# EAGLE design latch_shield_bittern (EAGLE 6.5.0)
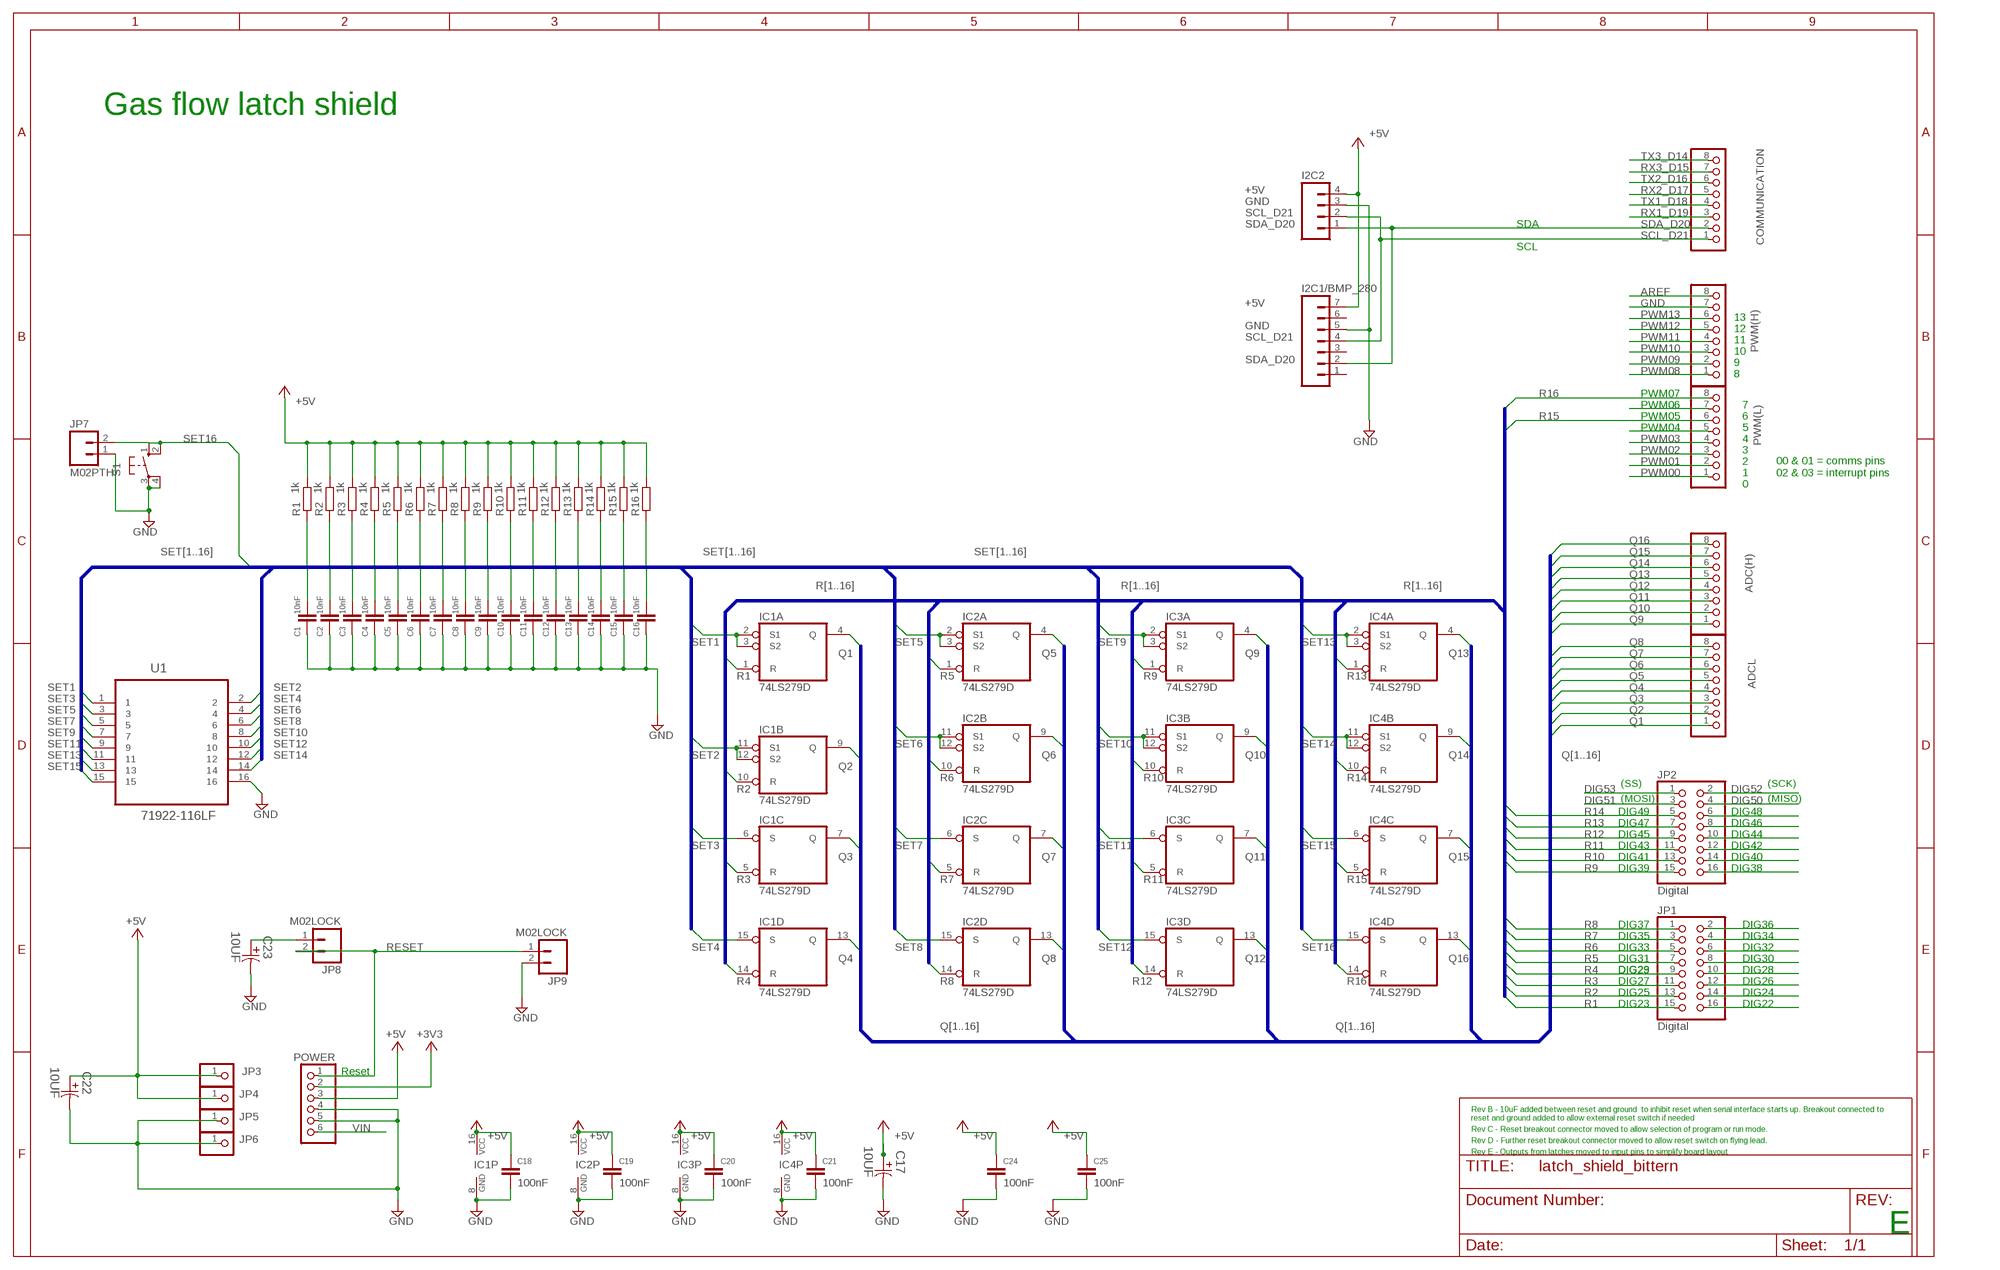
[diagram p0: schematic, sheet 1]

## Parts
ADC(H)  PINHD-1X8  [1X08]
ADCL  PINHD-1X8  [1X08]
C1  10nF  C-EUC0603  [C0603]
C2  10nF  C-EUC0603  [C0603]
C3  10nF  C-EUC0603  [C0603]
C4  10nF  C-EUC0603  [C0603]
C5  10nF  C-EUC0603  [C0603]
C6  10nF  C-EUC0603  [C0603]
C7  10nF  C-EUC0603  [C0603]
C8  10nF  C-EUC0603  [C0603]
C9  10nF  C-EUC0603  [C0603]
C10  10nF  C-EUC0603  [C0603]
C11  10nF  C-EUC0603  [C0603]
C12  10nF  C-EUC0603  [C0603]
C13  10nF  C-EUC0603  [C0603]
C14  10nF  C-EUC0603  [C0603]
C15  10nF  C-EUC0603  [C0603]
C16  10nF  C-EUC0603  [C0603]
C17  10UF  EEE-1VA100SR-CASE-C  [CAPAE530X610N]
C18  100nF  C-EUC0603  [C0603]
C19  100nF  C-EUC0603  [C0603]
C20  100nF  C-EUC0603  [C0603]
C21  100nF  C-EUC0603  [C0603]
C22  10UF  EEE-1VA100SR-CASE-C  [CAPAE530X610N]
C23  10UF  EEE-1VA100SR-CASE-C  [CAPAE530X610N]
C24  100nF  C-EUC0603  [C0603]
C25  100nF  C-EUC0603  [C0603]
COMMUNICATION  PINHD-1X8  [1X08]
I2C1/BMP_280  M07  [1X07]
I2C2  M04PTH  [1X04]
IC1  74LS279D  [SO16]
IC2  74LS279D  [SO16]
IC3  74LS279D  [SO16]
IC4  74LS279D  [SO16]
JP1  Digital  PINHD-2X8  [2X08]
JP2  Digital  PINHD-2X8  [2X08]
JP3  PINHD-1X1  [1X01]
JP4  PINHD-1X1  [1X01]
JP5  PINHD-1X1  [1X01]
JP6  PINHD-1X1  [1X01]
JP7  M02PTH  [1X02]
JP8  M02LOCK  [1X02_LOCK]
JP9  M02LOCK  [1X02_LOCK]
POWER  PINHD-1X6  [1X06]
PWM(H)  PINHD-1X8  [1X08]
PWM(L)  PINHD-1X8  [1X08]
R1  1k  R-EU_R0603  [R0603]
R2  1k  R-EU_R0603  [R0603]
R3  1k  R-EU_R0603  [R0603]
R4  1k  R-EU_R0603  [R0603]
R5  1k  R-EU_R0603  [R0603]
R6  1k  R-EU_R0603  [R0603]
R7  1k  R-EU_R0603  [R0603]
R8  1k  R-EU_R0603  [R0603]
R9  1k  R-EU_R0603  [R0603]
R10  1k  R-EU_R0603  [R0603]
R11  1k  R-EU_R0603  [R0603]
R12  1k  R-EU_R0603  [R0603]
R13  1k  R-EU_R0603  [R0603]
R14  1k  R-EU_R0603  [R0603]
R15  1k  R-EU_R0603  [R0603]
R16  1k  R-EU_R0603  [R0603]
S1  10-XX  [B3F-10XX]
U1  71922-116LF  [FCI_71922-116LF]

## Nets
+3V3 [power]: POWER.2
+5V [usbvcc]: C17.1 C18.1 C19.1 C20.1 C21.1 C22.1 C24.1 C25.1 I2C1/BMP_280.7 I2C2.4 IC1.16(P:VCC) IC2.16(P:VCC) IC3.16(P:VCC) IC4.16(P:VCC) JP3.1 JP4.1 POWER.3 R1.2 R2.2 R3.2 R4.2 R5.2 R6.2 R7.2 R8.2 R9.2 R10.2 R11.2 R12.2 R13.2 R14.2 R15.2 R16.2
AREF: PWM(H).8
DIG50: JP2.4
DIG51: JP2.3
DIG52: JP2.2
DIG53: JP2.1
GND [gnd]: C1.1 C2.1 C3.1 C4.1 C5.1 C6.1 C7.1 C8.1 C9.1 C10.1 C11.1 C12.1 C13.1 C14.1 C15.1 C16.1 C17.2 C18.2 C19.2 C20.2 C21.2 C22.2 C23.2 C24.2 C25.2 I2C1/BMP_280.5 I2C2.3 IC1.8(P:GND) IC2.8(P:GND) IC3.8(P:GND) IC4.8(P:GND) JP5.1 JP6.1 JP7.1 JP9.2 POWER.4 POWER.5 PWM(H).7 S1.3(P) S1.4(P1) U1.16
N$1: C23.1 JP8.1
N$2: PWM(L).5
N$3: PWM(L).7
N$4: JP2.6
N$5: JP2.8
N$6: JP2.10
N$7: JP2.12
N$8: JP2.14
N$9: JP2.16
N$10: JP1.2
N$11: JP1.4
N$12: JP1.6
N$13: JP1.8
N$14: JP1.10
N$15: JP1.12
N$16: JP1.14
N$17: JP1.16
PWM00: PWM(L).1
PWM01: PWM(L).2
PWM02: PWM(L).3
PWM03: PWM(L).4
PWM08: PWM(H).1
PWM09: PWM(H).2
PWM10: PWM(H).3
PWM11: PWM(H).4
PWM12: PWM(H).5
PWM13: PWM(H).6
Q1: ADCL.1 IC1.4(A:Q)
Q2: ADCL.2 IC1.9(B:Q)
Q3: ADCL.3 IC1.7(C:Q)
Q4: ADCL.4 IC1.13(D:Q)
Q5: ADCL.5 IC2.4(A:Q)
Q6: ADCL.6 IC2.9(B:Q)
Q7: ADCL.7 IC2.7(C:Q)
Q8: ADCL.8 IC2.13(D:Q)
Q9: ADC(H).1 IC3.4(A:Q)
Q10: ADC(H).2 IC3.9(B:Q)
Q11: ADC(H).3 IC3.7(C:Q)
Q12: ADC(H).4 IC3.13(D:Q)
Q13: ADC(H).5 IC4.4(A:Q)
Q14: ADC(H).6 IC4.9(B:Q)
Q15: ADC(H).7 IC4.7(C:Q)
Q16: ADC(H).8 IC4.13(D:Q)
R1: IC1.1(A:R) JP1.15
R2: IC1.10(B:R) JP1.13
R3: IC1.5(C:R) JP1.11
R4: IC1.14(D:R) JP1.9
R5: IC2.1(A:R) JP1.7
R6: IC2.10(B:R) JP1.5
R7: IC2.5(C:R) JP1.3
R8: IC2.14(D:R) JP1.1
R9: IC3.1(A:R) JP2.15
R10: IC3.10(B:R) JP2.13
R11: IC3.5(C:R) JP2.11
R12: IC3.14(D:R) JP2.9
R13: IC4.1(A:R) JP2.7
R14: IC4.10(B:R) JP2.5
R15: IC4.5(C:R) PWM(L).6
R16: IC4.14(D:R) PWM(L).8
RESET: JP8.2 JP9.1 POWER.1
RX1_D19: COMMUNICATION.3
RX2_D17: COMMUNICATION.5
RX3_D15: COMMUNICATION.7
SCL_D21: COMMUNICATION.1 I2C1/BMP_280.4 I2C2.2
SDA_D20: COMMUNICATION.2 I2C1/BMP_280.2 I2C2.1
SET1: C1.2 IC1.2(A:S1) IC1.3(A:S2) R1.1 U1.1
SET2: C2.2 IC1.11(B:S1) IC1.12(B:S2) R2.1 U1.2
SET3: C3.2 IC1.6(C:S) R3.1 U1.3
SET4: C4.2 IC1.15(D:S) R4.1 U1.4
SET5: C5.2 IC2.2(A:S1) IC2.3(A:S2) R5.1 U1.5
SET6: C6.2 IC2.11(B:S1) IC2.12(B:S2) R6.1 U1.6
SET7: C7.2 IC2.6(C:S) R7.1 U1.7
SET8: C8.2 IC2.15(D:S) R8.1 U1.8
SET9: C9.2 IC3.2(A:S1) IC3.3(A:S2) R9.1 U1.9
SET10: C10.2 IC3.11(B:S1) IC3.12(B:S2) R10.1 U1.10
SET11: C11.2 IC3.6(C:S) R11.1 U1.11
SET12: C12.2 IC3.15(D:S) R12.1 U1.12
SET13: C13.2 IC4.2(A:S1) IC4.3(A:S2) R13.1 U1.13
SET14: C14.2 IC4.11(B:S1) IC4.12(B:S2) R14.1 U1.14
SET15: C15.2 IC4.6(C:S) R15.1 U1.15
SET16: C16.2 IC4.15(D:S) JP7.2 R16.1 S1.1(S) S1.2(S1)
TX1_D18: COMMUNICATION.4
TX2_D16: COMMUNICATION.6
TX3_D14: COMMUNICATION.8
VIN [power]: POWER.6
Unconnected: I2C1/BMP_280.1 I2C1/BMP_280.3 I2C1/BMP_280.6

## Buses
Q[1..16]
R[1..16]
SET[1..16]

## Notes on the sheet
- Gas flow latch shield
- SDA
- SCL
- 13
- 12
- 11
- 10
- 9
- 8
- PWM07
- PWM06 | 7
- PWM05 | 6
- PWM04 | 5
- 4
- 3
- 2
- 1
- 00 & 01 = comms pins
  02 & 03 = interrupt pins
- 0
- (SS) | (SCK)
- (MOSI) | (MISO)
- DIG49 | DIG48
- DIG47 | DIG46
- DIG45 | DIG44
- DIG43 | DIG42
- DIG41 | DIG40
- DIG39 | DIG38
- DIG37 | DIG36
- DIG35 | DIG34
- DIG33 | DIG32
- DIG31 | DIG30
- DIG23 | DIG29 | DIG28
- DIG27 | DIG26
- DIG25 | DIG24
- DIG23 | DIG22
- Reset
- Rev B - 10uF added between reset and ground  to inhibit reset when serial interface starts up. Breakout connected to 
  reset and ground added to allow external reset switch if needed
- Rev C - Reset breakout connector moved to allow selection of program or run mode.
- Rev D - Further reset breakout connector moved to allow reset switch on flying lead.
- Rev E - Outputs from latches moved to input pins to simplify board layout
- E

## Library data of the parts
ADC(H) ADCL COMMUNICATION PWM(H) PWM(L) = pinhead:PINHD-1X8: PIN HEADER
C1-C16 C18-C21 C24 C25 = rcl:C-EU: CAPACITOR, European symbol
C17 C22 C23 = Panasonic-EEE0_EEE1_EEE2_EEEFC:EEE-: Aluminum Electrolytic Capacitors,Surface Mount Type; MPN: EEE-1VA100SR; OC_FARNELL: 9697012; OC_NEWARK: 96K9441; PACKAGE: CASE-C; SUPPLIER: PANASONIC; TOLERANCE: 20%; VOLTAGERATING: 35V
I2C1/BMP_280 = SparkFun-Connectors:M07: Header 7 Standard 7-pin 0.1" header. Use with straight break away headers (SKU : PRT-00116), right angle break away headers (PRT-00553), swiss pins (PRT-00743), machine pins (PRT-00117), and female headers (PRT-00115). NOTES ON THE VARIANTS LOCK and LOCK_LONGPADS... This footprint was designed to help hold the alignment of a through-hole component (i.e. 7-pin header) while soldering it into place. You may notice that each hole has been shifted either up or down by 0.005 of an inch from it's more standard position (which is usually a perfectly straight line). This slight alteration caused the pins (the squares in the middle) to touch the edges of the holes. Because they are alternating, it causes a "brace" to hold the header in place. 0.005 has proven to be the perfect amount of "off-center" position when using our standard breakaway headers. Although looks a little odd when you look at the bare footprint, once you have a header in there, the alteration is very hard to notice. Also, if you push a header all the way into place, it is covered up entirely on the bottom side. This idea of altering the position of holes to aid alignment will be further integrated into the Sparkfun Library for other footprints. It can help hold any component with 3 or more connection pins.
I2C2 = SparkFun-Connectors:M04: Header 4 Standard 4-pin 0.1" header. Use with straight break away headers (SKU : PRT-00116), right angle break away headers (PRT-00553), swiss pins (PRT-00743), machine pins (PRT-00117), and female headers (PRT-00115). Molex polarized connector foot print use with SKU : PRT-08231 with associated crimp pins and housings. 1MM SMD Version SKU: PRT-10208
IC1-IC4 = 74xx-eu:74*279: Quadruple S-R LATCH
JP1 JP2 = pinhead:PINHD-2X8: PIN HEADER
JP3-JP6 = pinhead:PINHD-1X1: PIN HEADER
JP7-JP9 = SparkFun-Connectors:M02: Standard 2-pin 0.1" header. Use with - straight break away headers ( PRT-00116) - right angle break away headers (PRT-00553) - swiss pins (PRT-00743) - machine pins (PRT-00117) - female headers (PRT-00115) Molex polarized connector foot print use with: PRT-08233 with associated crimp pins and housings. 2.54_SCREWTERM for use with PRT-10571. 3.5mm Screw Terminal footprints for PRT-08084 5mm Screw Terminal footprints for use with PRT-08433
POWER = pinhead:PINHD-1X6: PIN HEADER
R1-R16 = rcl:R-EU_: RESISTOR, European symbol
S1 = switch-omron:10-XX: OMRON SWITCH; MPN: B3F-1000; OC_FARNELL: 176432; OC_NEWARK: 36M3542
U1 = FCI_By_element14_Batch_1:71922-116LF: LATCH HEADER, RIGHT ANGLE; MPN: 71922-116LF; OC_FARNELL: 1103947; OC_NEWARK: 93K5024; PACKAGE: CON-16 WAYS; SUPPLIER: FCI

## Net classes
0 default: width 0.203 mm, drill 0.406 mm, clearance 0.203 mm
1 power: width 0.61 mm, drill 0.711 mm, clearance 0.203 mm
2 gnd: width 0.305 mm, drill 0.711 mm, clearance 0.203 mm
3 usbvcc: width 0.508 mm, drill 0.711 mm, clearance 0.203 mm

## Board
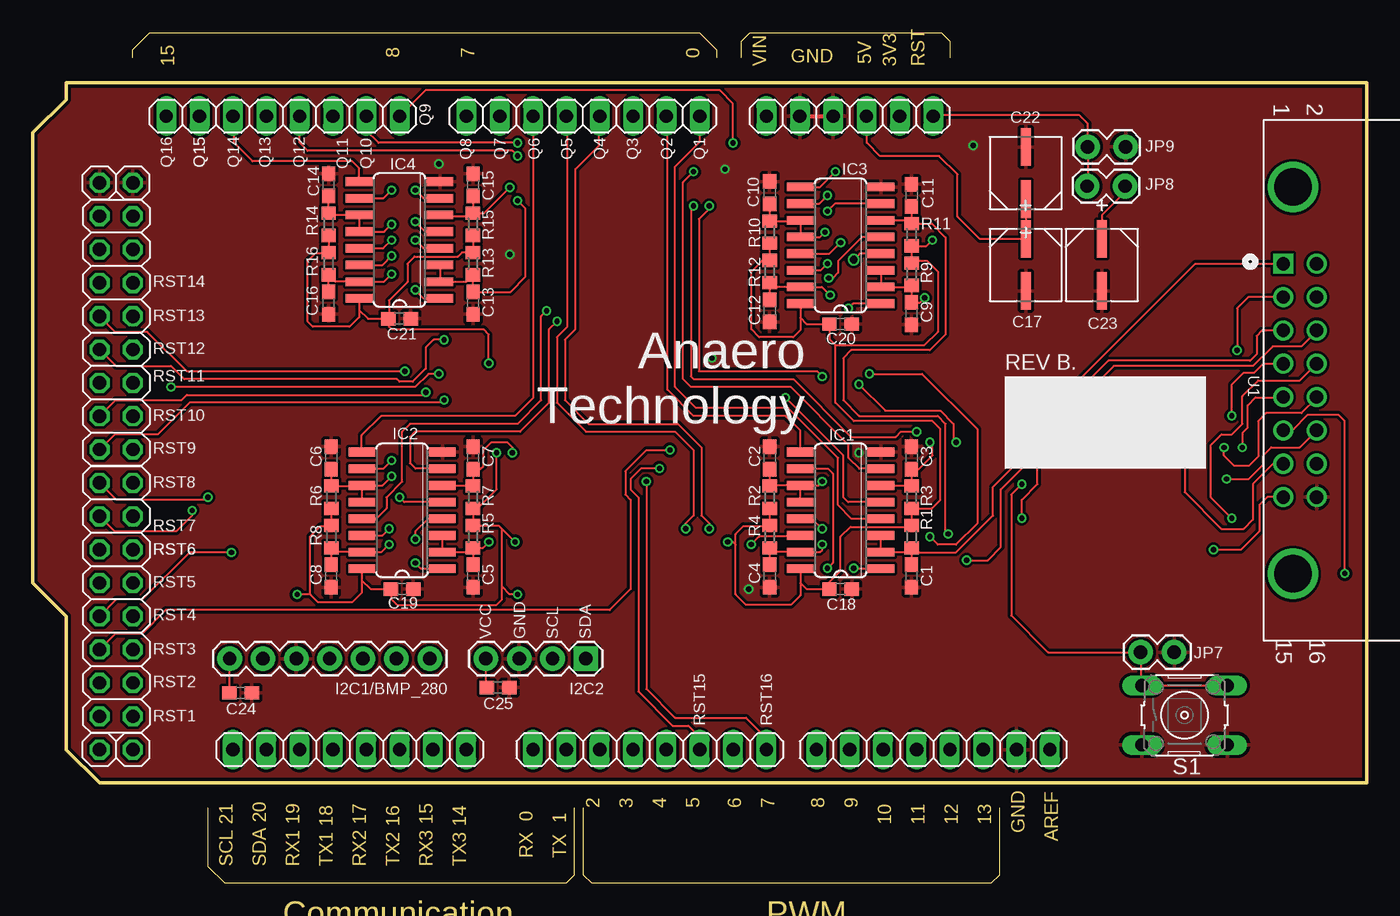
[diagram p1: board, top side]
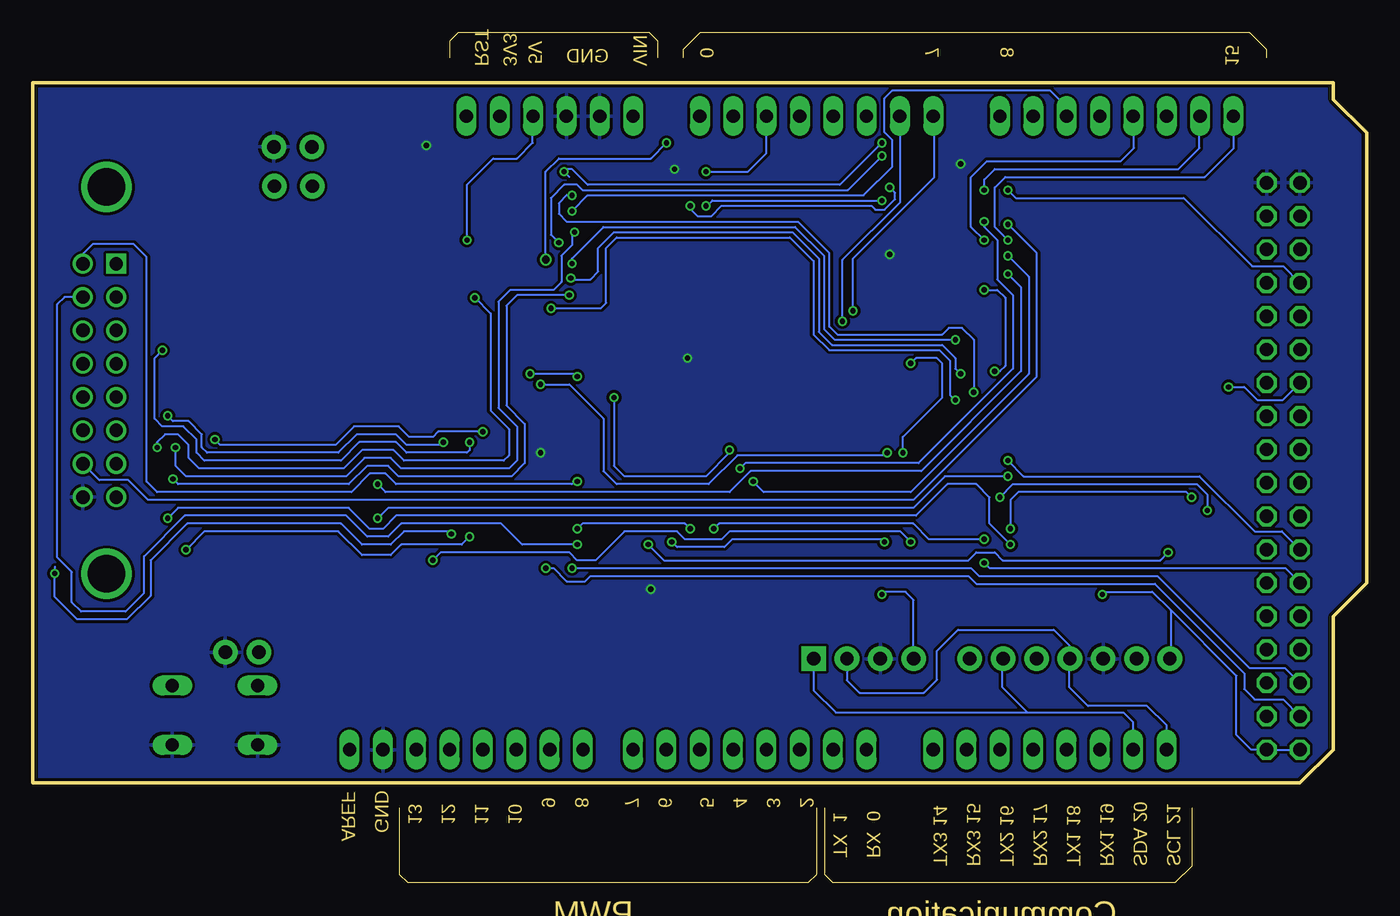
[diagram p2: board, bottom side, seen from below]

Size 101.6 x 64.77 mm. Coordinates in mm from the lower left corner, seen from the top.
Outline: 7.62,62.87 7.62,63.5 8.89,64.77 50.8,64.77 52.07,63.5 52.07,62.87
Outline: 53.97,62.87 53.97,64.14 54.61,64.77 69.22,64.77 69.85,64.14 69.85,62.87
Outline: 13.34,5.71 13.34,1.27 14.61,0 40.64,0 41.27,0.64 41.27,5.71
Outline: 41.91,5.71 41.91,0.64 42.54,0 73.03,0 73.66,0.64 73.66,5.71
Outline: 101.6,7.62 5.08,7.62 2.54,10.16 2.54,20.32 0,22.86 0,57.15 2.54,59.69 2.54,60.96 101.6,60.96 101.6,7.62
Copper layers (1*2*15*16): Top 0.035mm / dielectric 0.2mm / Route2 0.0175mm / dielectric 1.1mm / Route15 0.0175mm / dielectric 0.2mm / Bottom 0.035mm
Design rules "SeeedStudio_DRU_no_angle_20130527 *": minimum track width 6mil, minimum drill 9mil, track to track 6mil, track to pad 6mil, pad to pad 6mil, via to via 6mil, smd to smd 0mil, copper to edge 10mil, drill to drill 10mil, minimum pad ring 6mil, minimum via ring 6mil, stop-mask expansion 2mil, vias tented up to drill 25mil, thermal gap 10mil

### Footprints (pad centres in the part's own frame; a part is rotated, then mirrored left to right if it is on the bottom)
1X08 = drill 1.016 long: 1 -8.89,0; 2 -6.35,0; 3 -3.81,0; 4 -1.27,0; 5 1.27,0; 6 3.81,0; 7 6.35,0; 8 8.89,0
C0603 = smd 1.1 x 1: 1 -0.85,0; 2 0.85,0
CAPAE530X610N = smd 2.87 x 0.762: 1 -1.981,0; 2 1.981,0
1X07 = drill 1.016 pad 1.88: 1 0,0; 2 2.54,0; 3 5.08,0; 4 7.62,0; 5 10.16,0; 6 12.7,0; 7 15.24,0
1X04 = drill 1.016 pad 1.88 square: 1 0,0 | drill 1.016 pad 1.88: 2 2.54,0; 3 5.08,0; 4 7.62,0
SO16 = smd 0.66 x 2.032: 1 -4.445,-3.073; 2 -3.175,-3.073; 3 -1.905,-3.073; 4 -0.635,-3.073; 5 0.635,-3.073; 6 1.905,-3.073; 7 3.175,-3.073; 8 4.445,-3.073; 9 4.445,3.073; 10 3.175,3.073; 11 1.905,3.073; 12 0.635,3.073; 13 -0.635,3.073; 14 -1.905,3.073; 15 -3.175,3.073; 16 -4.445,3.073
2X08 = drill 1.016 octagon: 1 -8.89,-1.27; 2 -8.89,1.27; 3 -6.35,-1.27; 4 -6.35,1.27; 5 -3.81,-1.27; 6 -3.81,1.27; 7 -1.27,-1.27; 8 -1.27,1.27; 9 1.27,-1.27; 10 1.27,1.27; 11 3.81,-1.27; 12 3.81,1.27; 13 6.35,-1.27; 14 6.35,1.27; 15 8.89,-1.27; 16 8.89,1.27
1X01 = drill 1.016 octagon: 1 0,0
1X02 = drill 1.016 pad 1.88: 1 0,0; 2 2.54,0
1X02_LOCK = drill 1.016 pad 1.88: 1 -0.178,0; 2 2.718,0
1X06 = drill 1.016 long: 1 -6.35,0; 2 -3.81,0; 3 -1.27,0; 4 1.27,0; 5 3.81,0; 6 6.35,0
R0603 = smd 1 x 1.1: 1 -0.85,0; 2 0.85,0
B3F-10XX = drill 1.016 long: 1 -3.251,2.261; 2 3.251,2.261; 3 -3.251,-2.261; 4 3.251,-2.261
FCI_71922-116LF = drill 1.016 square: 1 -17.78,-2.54 | drill 1.016: 2 -17.78,0; 3 -15.24,-2.54; 4 -15.24,0; 5 -12.7,-2.54; 6 -12.7,0; 7 -10.16,-2.54; 8 -10.16,0; 9 -7.62,-2.54; 10 -7.62,0; 11 -5.08,-2.54; 12 -5.08,0; 13 -2.54,-2.54; 14 -2.54,0; 15 0,-2.54; 16 0,0 | drill 2.845: 17 -23.622,-1.803; 18 5.842,-1.803

### Placement (x,y rotation side)
ADC(H)  19.05,58.42 180 top
ADCL  41.91,58.42 180 top
C1  66.93,23.38 90 top
C2  56.13,32.38 270 top
C3  66.93,32.38 270 top
C4  56.13,23.38 90 top
C5  33.53,23.38 90 top
C6  22.73,32.38 270 top
C7  33.53,32.38 270 top
C8  22.73,23.38 90 top
C9  66.93,43.38 90 top
C10  56.13,52.59 270 top
C11  66.93,52.38 270 top
C12  56.13,43.59 90 top
C13  33.53,44.19 90 top
C14  22.53,53.19 270 top
C15  33.53,53.19 270 top
C16  22.53,44.19 90 top
C17  75.63,47.09 270 top
C18  61.53,22.39 0 top
C19  28.13,22.39 0 top
C20  61.53,42.59 0 top
C21  27.93,42.98 0 top
C22  75.63,54.09 90 top
C23  81.43,47.09 270 top
C24  15.83,14.48 0 top
C25  35.43,14.89 0 top
COMMUNICATION  24.13,10.16 0 top
I2C1/BMP_280  30.23,17.09 180 top
I2C2  42.13,17.09 180 top
IC1  61.53,28.38 90 top
IC2  28.13,28.38 90 top
IC3  61.53,48.59 90 top
IC4  27.93,48.98 90 top
JP1  6.35,21.59 270 top
JP2  6.35,41.91 270 top
JP3  7.62,10.16 180 top
JP4  5.08,10.16 180 top
JP5  7.62,53.34 180 top
JP6  5.08,53.34 180 top
JP7  86.93,17.59 180 top
JP8  83.03,53.09 180 top
JP9  80.53,56.09 0 top
POWER  62.23,58.42 180 top
PWM(H)  68.58,10.16 0 top
PWM(L)  46.99,10.16 0 top
R1  66.93,26.38 90 top
R2  56.13,29.38 270 top
R3  66.93,29.38 270 top
R4  56.13,26.38 90 top
R5  33.53,26.38 90 top
R6  22.73,29.38 270 top
R7  33.53,29.38 270 top
R8  22.73,26.38 90 top
R9  66.93,46.38 90 top
R10  56.13,49.59 270 top
R11  66.93,49.38 270 top
R12  56.13,46.59 90 top
R13  33.53,47.19 90 top
R14  22.53,50.19 270 top
R15  33.53,50.19 270 top
R16  22.53,47.19 90 top
S1  87.73,12.79 0 top
U1  97.79,29.4 270 top

### Tracks (layer width: path | path; a pad name or v marks a point on that pad's centre or on a via)
+5V  (via drill 0.4)
  Top 0.16: R14.2 R16.2 22.48,47.98 21.53,47.98 20.93,47.38 20.93,42.78 21.33,42.38 24.13,42.38 24.86,43.11 IC4.16 24.86,43.66 25.53,42.98 C21.1 | R15.2 R13.2 32.68,48.03 32.38,47.73 29.08,47.73 28.53,47.19 28.53,45.78 27.13,44.38 27.13,43.03 C21.1 | R6.2 R8.2 22.68,27.18 21.93,27.18 21.13,26.38 21.13,21.98 | R10.2 R12.2 56.08,47.38 55.53,47.38 54.73,46.59 54.73,42.19 55.33,41.59 57.93,41.59 58.46,42.11 IC3.16 58.46,43.06 58.93,42.59 C20.1 60.68,41.44 61.13,40.98 | R2.2 R4.2 56.08,27.18 54.13,27.18 53.53,26.59 53.53,25.79 | R1.2 R3.2 68.48,28.54 69.13,29.18 69.13,34.59 68.53,35.19 62.53,35.19 61.13,36.59 61.13,40.98 | C21.1 27.13,42.94 27.13,42.38 27.33,42.19 34.33,42.19 34.73,41.78 v34.73,39.59 | 21.13,21.98 21.73,21.39 24.33,21.39 25.06,22.11 IC2.16 25.06,23.06 25.73,22.39 C19.1 27.28,21.64 27.73,21.18 35.33,21.18 35.73,21.59 35.73,22.59 | 61.13,40.98 67.93,40.98 68.93,41.98 68.93,46.59 68.13,47.38 67.08,47.38 R9.2 R11.2 68.08,48.53 v68.53,48.98 | 66.98,27.18 R1.2 | 66.88,27.18 R1.2 | 53.53,25.79 53.53,21.98 54.33,21.18 57.73,21.18 58.46,21.91 IC1.16 58.46,22.86 58.93,22.39 C18.1 60.68,22.93 61.53,23.79 61.53,26.38 62.28,27.13 66.83,27.13 R1.2 | 35.73,22.59 35.73,26.98 | 35.73,26.98 35.53,27.18 33.58,27.18 R5.2 R7.2 33.88,28.54 35.33,29.98 v35.33,32.79 | 35.73,26.98 v36.73,25.98 | v52.93,25.98 53.33,25.98 53.53,25.79 | 21.13,21.98 v20.13,21.98 | 66.78,27.09 R1.2 | v36.93,21.98 36.33,21.98 35.73,22.59 | C22.1 C17.1 72.15,49.07 70.43,50.78 70.43,53.98 69.03,55.38 64.53,55.38 63.53,56.38 63.53,58.39 POWER.3 | C24.1 I2C1/BMP_280.7 | C25.1 34.51,14.89 I2C2.4
  Bottom 0.16: v68.53,48.98 68.53,53.19 66.53,55.19 64.73,55.19 63.53,56.38 63.53,58.39 POWER.3 | v35.33,32.79 35.33,33.98 32.33,36.98 32.33,39.59 32.73,39.98 34.33,39.98 v34.73,39.59 | v36.73,25.98 36.93,26.18 48.33,26.18 48.93,25.59 52.53,25.59 v52.93,25.98 | 14.93,20.79 16.33,22.18 19.93,22.18 v20.13,21.98 | 14.93,20.79 14.93,17.14 I2C1/BMP_280.7 | JP4.1 JP3.1 8.8,10.16 9.93,11.29 9.93,15.79 14.93,20.79 | I2C2.4 34.51,21.57 35.13,22.18 36.73,22.18 v36.93,21.98
GND  (via drill 0.4)
  Top 0.305: POWER.5 POWER.4
  other vias: 52.73,54.38 36.33,47.88 30.93,54.78 54.53,22.39 51.73,39.98 62.93,32.79 71.63,56.19
  pour Top: -2.87,63.78 -2.87,-0.42 114.93,-0.42 114.93,63.78
  pour Bottom: -5.67,66.19 -5.67,1.99 112.13,1.99 112.13,66.19
N$1
  Top 0.16: JP8.1 83.21,52.66 81.43,50.88 C23.1
Q1
  Top 0.16: IC1.4 62.36,27.75 61.33,28.79 61.33,32.38 57.53,36.19 50.53,36.19 48.93,37.79 48.93,54.59 50.8,56.45 ADCL.1
Q2
  Top 0.16: IC1.9 58.46,34.46 57.33,35.59 50.33,35.59 48.33,37.59 48.33,58.35 ADCL.2
  Top 0.406: 48.43,58.25 ADCL.2
Q3  (via drill 0.4)
  Top 0.16: v50.33,54.19 49.53,53.38 49.53,38.38 50.13,37.79 57.73,37.79 62.13,33.38 62.13,32.38 62.95,31.56 IC1.7
  Bottom 0.16: v50.33,54.19 47.13,54.19 45.73,55.59 45.73,58.41 ADCL.3
Q4  (via drill 0.4)
  Top 0.16: IC1.13 59.36,27.75 v60.13,26.98 | ADCL.4 43.13,58.37 43.13,56.19 41.33,54.38 41.33,42.19 40.53,41.38 40.53,36.79 42.33,34.98 49.13,34.98 50.93,33.19 50.93,27.98 51.53,27.38 v51.53,26.98
  Bottom 0.16: v60.13,26.98 59.73,27.38 51.93,27.38 v51.53,26.98
Q5  (via drill 0.4)
  Top 0.16: IC2.4 30.09,27.75 29.13,26.79 v29.13,26.18 | ADCL.5 40.73,58.33 40.73,42.38 39.93,41.59 39.93,36.59 42.13,34.38 48.93,34.38 50.33,32.98 50.33,27.98 49.73,27.38 v49.73,26.98
  Bottom 0.16: v29.13,26.18 33.33,26.18 34.53,27.38 49.33,27.38 v49.73,26.98
Q6
  Top 0.16: IC2.9 25.06,34.11 26.53,35.59 36.73,35.59 38.13,36.98 38.13,58.39 ADCL.6
Q7  (via drill 0.4)
  Top 0.16: IC2.7 29.16,31.56 28.73,31.98 28.73,33.98 29.13,34.38 37.13,34.38 39.33,36.59 39.33,42.19 v39.93,42.78
  Bottom 0.16: v39.93,42.78 39.93,47.48 35.53,51.88 35.53,58.39 ADCL.7
Q8  (via drill 0.4)
  Top 0.16: IC2.13 26.13,27.75 26.93,28.55 26.93,29.38 28.13,30.59 28.13,34.38 28.73,34.98 36.93,34.98 38.73,36.79 38.73,43.19 v39.13,43.59
  Bottom 0.16: v39.13,43.59 39.13,47.59 32.93,53.78 32.93,58.33 ADCL.8
Q9  (via drill 0.4, 0.6)
  Top 0.16: v53.33,56.38 53.33,59.38 52.33,60.38 29.91,60.38 ADC(H).1 | 65.53,47.95 IC3.4 62.99,47.95 v62.53,47.48
  Bottom 0.16: v62.53,47.48 62.53,54.19 61.53,55.19 54.53,55.19 v53.33,56.38
Q10  (via drill 0.4)
  Top 0.16: v36.93,56.38 26.33,56.38 25.33,57.38 25.33,58.35 ADC(H).2 | IC3.9 59.97,53.03 v61.13,54.19
  Bottom 0.16: v36.93,56.38 40.13,53.19 59.33,53.19 60.53,54.38 60.93,54.38 v61.13,54.19 60.73,53.78
Q11  (via drill 0.4)
  Top 0.16: IC3.7 61.1,51.76 v60.53,51.19
  Bottom 0.16: v60.53,51.19 59.33,52.38 38.33,52.38 36.13,54.59 36.13,56.59 36.73,57.19 36.73,59.78 36.13,60.38 24.13,60.38 22.93,59.19 22.93,58.49 ADC(H).3 22.93,58.35
Q12  (via drill 0.4)
  Top 0.16: IC3.13 60.7,47.95 v61.53,48.78 | ADC(H).4 20.33,58.41 20.33,56.38 20.93,55.78 36.53,55.78 v36.93,55.38
  Bottom 0.16: v36.93,55.38 39.53,52.78 59.73,52.78 60.13,53.19 61.13,53.19 62.13,52.19 62.13,49.38 v61.53,48.78
Q13  (via drill 0.4)
  Top 0.16: IC4.4 29.77,48.35 v29.13,48.98
  Bottom 0.16: v29.13,48.98 30.13,49.98 30.13,53.78 28.93,54.98 18.73,54.98 17.73,55.98 17.73,58.37 ADC(H).5
Q14
  Top 0.16: IC4.9 24.86,54.46 24.33,54.98 16.73,54.98 15.33,56.38 15.33,58.33 ADC(H).6
Q15  (via drill 0.4)
  Top 0.16: IC4.7 29.75,52.16 v29.13,52.78
  Bottom 0.16: v29.13,52.78 29.13,53.59 28.33,54.38 14.33,54.38 12.73,55.98 12.73,58.39 ADC(H).7
Q16  (via drill 0.4)
  Top 0.16: IC4.13 26.7,48.35 v27.33,48.98
  Bottom 0.16: v27.33,48.98 28.33,49.98 28.33,52.98 27.53,53.78 12.33,53.78 10.13,55.98 10.13,58.39 ADC(H).8
R1  (via drill 0.4)
  Top 0.16: IC1.1 62.57,23.94 v62.53,23.98
  Bottom 0.16: v62.53,23.98 61.93,23.98 60.93,22.98 59.53,22.98 59.13,23.38 30.33,23.38 29.73,22.79 16.13,22.79 9.33,15.98 9.33,14.79 8.53,13.98 6.37,13.98 JP1.15
R2  (via drill 0.4)
  Top 0.16: IC1.10 60.55,31.56 60.93,31.18 60.93,24.38 v60.53,23.98
  Bottom 0.16: v60.53,23.98 30.13,23.98 29.53,23.38 15.93,23.38 8.93,16.39 6.22,16.39 JP1.13
R3  (via drill 0.4)
  Top 0.16: IC1.5 62.09,29.02 61.73,29.38 61.73,32.59 v57.33,36.98 | JP1.11 6.29,18.98 8.33,18.98 10.13,20.79 43.93,20.79 45.53,22.39 45.53,29.18 45.13,29.59 45.13,31.38 46.73,32.98 v48.53,32.98
  Bottom 0.16: v57.33,36.98 57.33,31.79 56.53,30.98 50.33,30.98 48.53,32.79 v48.53,32.98
R4  (via drill 0.4)
  Top 0.16: IC1.14 58.02,26.48 57.93,26.38 55.33,26.38 v54.73,25.79 | v15.13,25.18 11.93,25.18 8.33,21.59 6.35,21.59 JP1.9
  Bottom 0.16: v54.73,25.79 53.53,24.59 30.33,24.59 29.73,25.18 28.33,25.18 27.73,24.59 15.73,24.59 v15.13,25.18
R5  (via drill 0.4)
  Top 0.16: IC2.1 29.57,23.94 v29.13,24.38
  Bottom 0.16: v29.13,24.38 28.73,23.98 6.21,23.98 JP1.7
R6  (via drill 0.4)
  Top 0.16: IC2.10 26.71,31.56 v27.33,32.19
  Bottom 0.16: v27.33,32.19 26.13,30.98 12.73,30.98 8.53,26.79 6.46,26.79 JP1.5
R7  (via drill 0.4)
  Top 0.16: IC2.5 28.3,29.02 v27.93,29.38 | v12.13,28.38 12.13,27.98 10.93,26.79 6.23,26.79 JP1.3
  Bottom 0.16: v27.93,29.38 26.93,30.38 12.93,30.38 12.13,29.59 v12.13,28.38
R8  (via drill 0.4)
  Top 0.16: IC2.14 26.62,26.48 v27.13,26.98 | v13.33,29.38 13.13,29.18 6.38,29.18 JP1.1
  Bottom 0.16: v13.33,29.38 13.73,29.79 26.53,29.79 27.13,29.18 v27.13,26.98
R9  (via drill 0.4)
  Top 0.16: JP2.15 6.24,34.19 9.53,34.19 11.93,36.59 31.13,36.59 v31.33,36.79 | IC3.1 62.48,44.14 v62.13,43.78
  Bottom 0.16: v62.13,43.78 58.33,43.78 57.93,44.19 57.93,48.38 57.13,49.19 43.93,49.19 42.13,47.38 42.13,41.78 40.93,40.59 32.53,40.59 31.73,39.78 31.73,37.19 v31.33,36.79
R10  (via drill 0.4)
  Top 0.16: IC3.10 59.9,51.76 v60.53,52.38 | JP2.13 6.3,36.79 11.33,36.79 11.73,37.19 29.73,37.19 v29.93,37.38
  Bottom 0.16: v60.53,52.38 60.93,52.38 61.53,51.78 61.53,50.98 60.93,50.38 43.33,50.38 40.93,47.98 40.93,42.38 40.33,41.78 32.33,41.78 31.83,42.28 30.83,42.28 29.93,41.38 v29.93,37.38
R11  (via drill 0.4)
  Top 0.16: IC3.5 63.16,49.22 61.33,47.38 61.33,46.48 60.93,46.09 v60.63,46.09 | v30.93,38.79 30.13,38.79 29.13,37.79 v10.53,37.79
  Bottom 0.16: v30.93,38.79 31.33,39.19 31.33,39.98 32.33,40.98 40.73,40.98 41.73,41.98 41.73,47.59 43.73,49.59 57.33,49.59 58.53,48.38 58.53,46.59 59.13,45.98 60.53,45.98 v60.63,46.09 | v10.53,37.79 9.33,37.79 8.33,36.79 6.39,36.79 JP2.11
R12  (via drill 0.4)
  Top 0.16: IC3.14 60.02,46.68 v60.53,47.19 | v31.33,41.38 30.53,41.38 29.93,40.78 29.93,39.19 28.93,38.19 27.93,38.19 27.73,38.38 11.53,38.38 10.53,39.38 6.34,39.38 JP2.9
  Bottom 0.16: v60.53,47.19 60.53,47.59 58.13,49.98 43.53,49.98 41.33,47.78 41.33,42.19 40.53,41.38 v31.33,41.38
R13  (via drill 0.4)
  Top 0.16: IC4.1 29.78,44.54 v29.13,45.19 | JP2.7 6.28,41.98 8.73,41.98 11.73,38.98 v28.33,38.98
  Bottom 0.16: v29.13,45.19 28.13,45.19 27.53,44.59 27.53,39.38 27.93,38.98 v28.33,38.98
R14  (via drill 0.4)
  Top 0.16: IC4.10 26.71,52.16 v27.33,52.78
  Bottom 0.16: v27.33,52.78 26.73,52.19 13.93,52.19 8.73,46.98 6.35,46.98 JP2.5
R15  (via drill 0.4)
  Top 0.16: IC4.5 29.89,49.62 v29.13,50.38 | PWM(L).6 50.73,10.23 50.73,11.19 49.93,11.98 48.73,11.98 46.13,14.59 46.13,29.38 45.53,29.98 45.53,30.79 46.33,31.59 v47.73,31.59
  Bottom 0.16: v29.13,50.38 29.13,49.98 28.13,48.98 28.13,45.98 26.93,44.78 26.93,39.19 34.13,31.98 47.33,31.98 v47.73,31.59
R16  (via drill 0.4)
  Top 0.16: IC4.14 26.62,47.08 v27.33,47.78 | PWM(L).8 55.93,10.21 55.93,10.98 54.33,12.59 48.93,12.59 46.73,14.79 v46.73,30.59
  Bottom 0.16: v27.33,47.78 25.73,46.19 25.73,38.79 34.73,29.79 45.93,29.79 v46.73,30.59
RESET
  Top 0.16: POWER.1 68.65,58.48 79.73,58.48 80.35,57.86 JP9.1 80.35,53.12 JP8.2
SCL_D21
  Bottom 0.16: COMMUNICATION.1 15.24,12 16.73,13.48 21.23,13.48 22.63,14.89 22.63,17.07 I2C1/BMP_280.4 22.63,17.11 22.63,18.09 23.83,19.29 31.13,19.29 32.73,17.68 32.73,15.48 33.73,14.48 38.63,14.48 39.59,15.45 I2C2.2
SDA_D20
  Bottom 0.16: COMMUNICATION.2 17.78,12.23 18.53,12.98 25.73,12.98 25.83,12.98 | 25.83,12.98 27.73,14.89 27.73,17.05 I2C1/BMP_280.2 | I2C2.1 42.13,14.69 40.43,12.98 25.83,12.98
SET1
  Top 0.16: R1.1 C1.2 | R1.1 66.61,25.21 IC1.2 IC1.3 | R1.1 67.18,25.54 67.53,25.18 70.33,25.18 73.13,27.98 73.13,30.18 75.33,32.38 75.33,33.98 88.53,47.19 U1.1
SET2  (via drill 0.4)
  Top 0.16: C2.2 R2.1 56.18,30.29 IC1.11 | IC1.12 IC1.11 | IC1.11 59.83,30.29 v60.13,30.59
  Bottom 0.16: v60.13,30.59 60.33,30.59 60.53,30.38 73.93,30.38 74.73,31.18 75.93,31.18 77.33,29.79 92.13,29.79 92.93,30.59 92.93,47.69 93.93,48.69 97.03,48.69 97.73,47.98 97.73,47.24 U1.2
SET3  (via drill 0.4)
  Top 0.16: IC1.6 64.66,30.23 R3.1 C3.2 67.48,31.54 68.53,32.59 68.53,33.38 v68.33,33.59 | U1.3 92.59,44.64 91.73,43.78 v91.73,40.59
  Bottom 0.16: v91.73,40.59 92.33,39.98 92.33,35.38 91.73,34.79 90.13,34.79 89.13,33.79 89.13,32.79 88.53,32.19 78.13,32.19 76.73,33.59 73.93,33.59 73.13,32.79 68.53,32.79 68.33,32.98 v68.33,33.59
SET4  (via drill 0.4)
  Top 0.16: C4.2 R4.1 56.45,25.21 IC1.15 59.95,25.21 60.13,25.38 v60.13,25.79
  Bottom 0.16: v60.13,25.79 64.33,25.79 65.93,27.38 73.53,27.38 74.53,26.38 76.13,26.38 77.73,27.98 90.03,27.98 93.13,24.88 93.13,22.09 94.53,20.68 97.93,20.68 98.63,21.39 98.63,23.68 99.73,24.79 99.73,44.09 99.17,44.64 U1.4
SET5  (via drill 0.4)
  Top 0.16: R5.1 C5.2 | R5.1 33.2,25.21 IC2.2 IC2.3 | R5.1 34.28,25.54 v34.73,25.98 | v71.13,24.59 72.73,24.59 73.73,25.59 73.73,29.98 75.93,32.19 75.93,33.79 81.93,39.78 92.73,39.78 93.23,40.28 93.23,41.69 93.63,42.09 95.23,42.09 U1.5
  Bottom 0.16: v34.73,25.98 35.53,26.79 48.53,26.79 49.13,26.18 51.93,26.18 52.53,26.79 56.53,26.79 58.73,24.59 60.13,24.59 60.73,25.18 70.53,25.18 v71.13,24.59
SET6  (via drill 0.4)
  Top 0.16: C6.2 R6.1 25,30.23 IC2.11 | IC2.11 IC2.12 | IC2.11 26.64,30.29 v27.33,30.98 | v75.33,27.79 75.33,29.18 76.53,30.38 76.53,33.59 82.33,39.38 92.93,39.38 94.43,40.88 96.63,40.88 97.79,42.05 U1.6
  Bottom 0.16: v27.33,30.98 32.13,30.98 34.53,28.59 74.53,28.59 v75.33,27.79
SET7  (via drill 0.4)
  Top 0.16: IC2.6 31.26,30.23 R7.1 C7.2 34.08,31.54 34.33,31.79 34.33,32.98 34.93,33.59 36.13,33.59 36.53,33.19 v36.53,32.79 | v70.33,33.59 70.13,33.79 70.13,34.98 69.13,35.98 64.93,35.98 v62.93,37.98 | v91.33,35.59 91.33,37.98 92.23,38.88 93.03,38.88 93.73,39.59 95.23,39.59 U1.7
  Bottom 0.16: v36.53,32.79 36.73,32.59 47.93,32.59 50.13,30.38 57.13,30.38 58.13,31.38 58.13,35.38 60.73,37.98 v62.93,37.98 | v70.33,33.59 70.53,33.38 73.13,33.38 73.93,34.19 76.93,34.19 78.33,32.79 88.33,32.79 88.73,33.19 88.73,34.19 89.73,35.19 90.93,35.19 v91.33,35.59
SET8  (via drill 0.4)
  Top 0.16: C8.2 R8.1 23.05,25.21 IC2.15 26.55,25.21 v27.13,25.79 | v91.33,27.79 89.73,29.38 89.73,33.38 90.53,34.19 91.33,34.19 92.13,34.98 92.13,37.09 93.33,38.29 96.52,38.29 U1.8
  Bottom 0.16: v91.33,27.79 90.53,28.59 77.53,28.59 75.93,26.98 74.93,26.98 73.93,27.98 34.33,27.98 31.93,30.38 29.73,30.38 28.73,29.38 28.73,27.38 v27.13,25.79
SET9  (via drill 0.4)
  Top 0.16: IC3.3 IC3.2 66.81,45.41 R9.1 C9.2 67.58,44.23 v67.93,44.59 | U1.9 95.22,36.98 93.13,36.98 92.53,36.38 92.53,34.69 92.13,34.29 v92.13,33.19
  Bottom 0.16: v67.93,44.59 66.73,43.38 66.73,35.98 65.33,34.59 65.33,32.59 65.73,32.19 73.33,32.19 74.13,32.98 76.53,32.98 77.93,31.59 88.93,31.59 89.73,32.38 89.73,33.38 90.53,34.19 91.53,34.19 92.13,33.59 v92.13,33.19
SET10  (via drill 0.4)
  Top 0.16: C10.2 R10.1 58.4,50.44 IC3.11 IC3.12 59.96,49.22 v60.33,49.59 | v90.73,33.19 90.73,32.59 91.53,31.79 92.63,31.79 93.33,32.48 93.33,35.19 93.93,35.79 96.63,35.79 97.79,36.95 U1.10
  Bottom 0.16: v60.33,49.59 60.53,49.38 60.53,48.59 61.33,47.78 61.33,45.78 61.93,45.19 65.23,45.19 66.13,44.28 66.13,36.19 64.73,34.79 64.73,32.19 65.33,31.59 73.53,31.59 74.33,32.38 76.33,32.38 77.73,30.98 89.93,30.98 90.73,31.79 v90.73,33.19
SET11  (via drill 0.4)
  Top 0.16: 66.93,51.59 C11.2 R11.1 | IC3.6 66.67,50.49 R11.1 | R11.1 68.48,50.23 69.53,49.19 69.53,41.78 68.33,40.59 62.33,40.59 61.73,39.98 61.73,36.79 62.93,35.59 68.93,35.59 69.53,34.98 69.53,26.79 v69.73,26.59 | v99.93,23.59 99.93,35.19 99.43,35.69 97.13,35.69 95.92,34.48 U1.11
  Bottom 0.16: v69.73,26.59 69.93,26.79 73.33,26.79 74.33,25.79 76.53,25.79 78.13,27.38 89.83,27.38 92.63,24.59 92.63,21.89 94.43,20.09 98.23,20.09 99.93,21.79 v99.93,23.59 99.93,24.09
SET12  (via drill 0.4)
  Top 0.16: C12.2 R12.1 56.45,45.41 IC3.15 60.1,45.41 v60.73,44.78 | v90.93,30.79 92.63,30.79 93.73,31.88 93.73,32.59 94.33,33.19 96.5,33.19 U1.12
  Bottom 0.16: v90.93,30.79 90.53,30.38 77.53,30.38 76.13,31.79 74.53,31.79 73.73,30.98 65.13,30.98 64.13,31.98 64.13,34.98 65.53,36.38 65.53,43.98 64.73,44.78 v60.73,44.78
SET13  (via drill 0.4)
  Top 0.16: IC4.3 IC4.2 33,45.81 R13.1 C13.2 36.38,45.03 37.53,46.19 37.53,51.38 v36.93,51.98 | v50.33,51.59 50.13,51.38 50.13,38.59 50.33,38.38 57.93,38.38 62.33,33.98 65.73,33.98 66.13,34.38 v67.33,34.38 | v87.73,33.79 87.73,29.79 90.53,26.98 92.23,26.98 92.93,27.68 92.93,30.38 94.48,31.94 U1.13
  Bottom 0.16: v50.33,51.59 50.13,51.78 50.03,51.78 49.83,51.98 v36.93,51.98 | v67.33,34.38 70.73,34.38 71.13,33.98 72.93,33.98 73.73,34.79 77.13,34.79 78.53,33.38 87.33,33.38 v87.73,33.79
SET14  (via drill 0.4)
  Top 0.16: C14.2 R14.1 22.68,50.89 IC4.11 IC4.12 26.77,49.62 v27.33,50.19
  Bottom 0.16: v27.33,50.19 25.13,47.98 25.13,38.59 34.53,29.18 92.83,29.18 94.33,30.68 96.54,30.68 U1.14
SET15  (via drill 0.4)
  Top 0.16: C15.2 R15.1 | R15.1 33.38,51.03 33.13,50.78 31.11,50.78 IC4.6 | R15.1 34.38,51.03 v36.33,52.98 | v51.53,51.59 51.53,51.38 50.73,50.59 50.73,38.98 59.73,38.98 v60.13,38.59 | v63.73,38.79 67.73,38.79 71.93,34.59 71.93,27.38 70.33,25.79 68.93,25.79 v68.33,26.38 | U1.15 94.05,29.4 93.43,28.79 93.43,26.79 92.03,25.38 v89.93,25.38
  Bottom 0.16: v36.33,52.98 35.93,52.59 35.93,52.09 36.73,51.28 37.43,51.28 37.73,51.59 49.13,51.59 49.93,50.78 50.93,50.78 51.53,51.38 v51.53,51.59 | v68.33,26.38 68.93,25.79 73.53,25.79 74.33,24.98 76.53,24.98 78.33,26.79 88.53,26.79 v89.93,25.38 | v60.13,38.59 60.33,38.79 v63.73,38.79
SET16  (via drill 0.4)
  Top 0.16: C16.2 R16.1 23.05,45.81 IC4.15 26.75,45.81 v27.33,46.38 | v75.33,30.38 74.53,29.59 74.53,20.39 77.33,17.59 JP7.2 84.39,15.13 S1.1 S1.2
  Bottom 0.16: v27.33,46.38 26.33,45.38 26.33,38.98 33.93,31.38 46.93,31.38 48.53,29.79 74.73,29.79 v75.33,30.38

### Text on the board
Dimension: 3V3 | GND | 5V | 8 | 7 | 0 | 15 | VIN | RST | 2 | 3 | 4 | 5 | 6 | 7 | 8 | 9 | 10 | 11 | 12 | 13 | GND | AREF | RX 0 | TX 1 | SCL 21 | SDA 20 | RX1 19 | TX1 18 | RX2 17 | TX2 16 | RX3 15 | TX3 14 | Communication | PWM
tOrigins: Analog In | Power
tNames: Q9 | Q16 | Q15 | Q15 | Q14 | Q13 | Q12 | Q8 | Q7 | Q6 | Q5 | Q4 | Q3 | Q2 | Q1 | Q11 | Q10 | RST14 | RST13 | Anaero / Technology | RST12 | REV B. | RST11 | RST10 | RST9 | RST8 | RST7 | RST6 | RST6 | RST5 | RST4 | VCC | GND | SCL | SDA | RST3 | RST2 | RST1 | RST15 | RST16